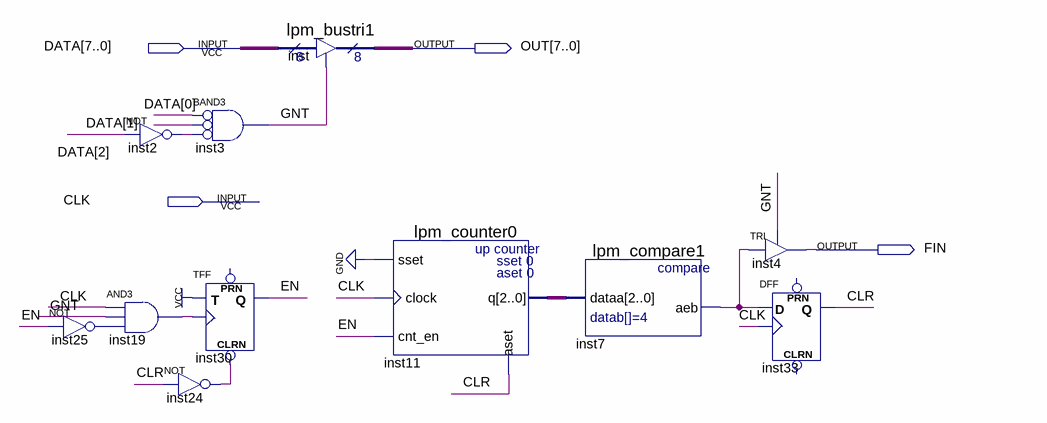
[diagram p0: schematic sheet]
// Quartus schematic slave4.bdf as structural Verilog: 11 symbols, 4 pins
module slave4 (
  input  [7:0] DATA,
  input  CLK,
  output [7:0] OUT,
  output FIN
);

  wire CLR, EN, GNT, inst2_out, inst7_aeb, inst19_out, inst24_out, inst25_out;
  wire [2:0] inst11_q;

  and inst19 (inst19_out, CLK, GNT, inst25_out);
  not inst25 (inst25_out, EN);
  not inst2 (inst2_out, DATA[2]);
  not inst24 (inst24_out, CLR);
  and inst3 (GNT, ~DATA[0], ~DATA[1], ~inst2_out);  // BAND3
  TFF inst30 (.CLRN(inst24_out), .T(1'b1), .CLK(inst19_out), .Q(EN));  // open: PRN
  lpm_bustri1 inst (.enabledt(GNT), .data(DATA), .tridata(OUT));
  lpm_counter0 inst11 (.sset(1'b0), .clock(CLK), .cnt_en(EN), .aset(CLR), .q(inst11_q));
  lpm_compare1 inst7 (.dataa(inst11_q), .aeb(inst7_aeb));
  TRI inst4 (.IN(inst7_aeb), .OE(GNT), .OUT(FIN));
  DFF inst33 (.CLK(CLK), .D(inst7_aeb), .Q(CLR));  // open: CLRN, PRN
endmodule
